# EAGLE design m1-center-plane (EAGLE 9.5.2)
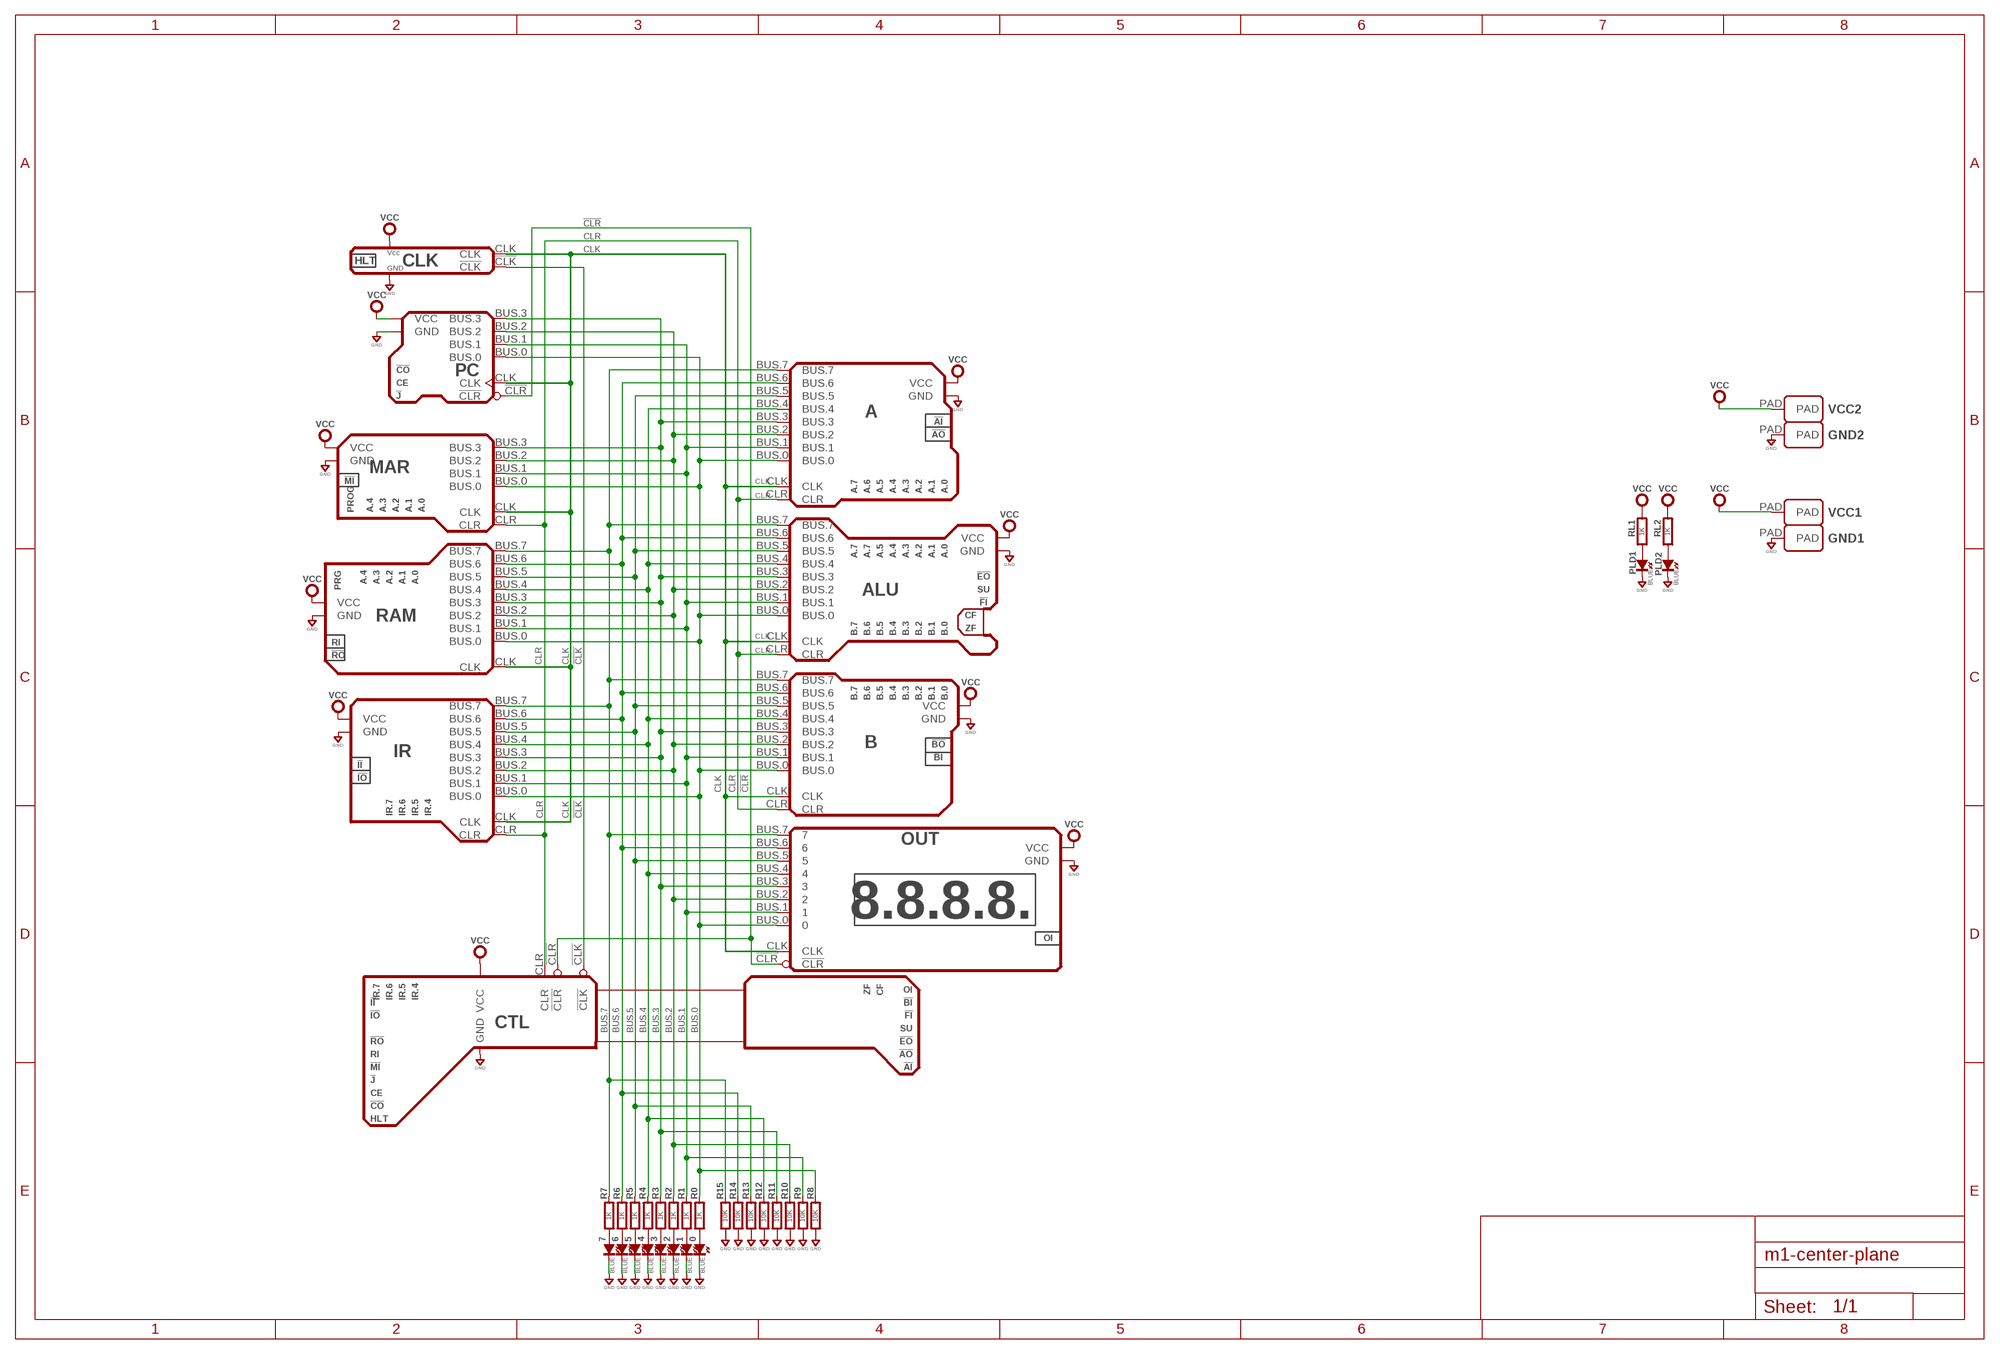
[diagram p0: schematic, sheet 1]

## Parts
0  BLUE  SMT0603  [SMD_0603]
1  BLUE  SMT0603  [SMD_0603]
2  BLUE  SMT0603  [SMD_0603]
3  BLUE  SMT0603  [SMD_0603]
4  BLUE  SMT0603  [SMD_0603]
5  BLUE  SMT0603  [SMD_0603]
6  BLUE  SMT0603  [SMD_0603]
7  BLUE  SMT0603  [SMD_0603]
A  M1-REG-A-BUS  [M1-REG-A-BUS]
ALU  M1-ALU-BUS  [M1-ALU-BUS]
B  M1-REG-B-BUS  [M1-REG-B-BUS]
CLK  M1-CLOCK-BUS  [M1-CLOCK-BUS]
CTL  M1-CONTROL-BUS  [M1-CONTROL-BUS]
GND1  PADSMD-100X100  [SMD-100X100]
GND2  PADSMD-100X100  [SMD-100X100]
IR  M1-REG-INSTR-BUS  [M1-REG-I-BUS]
MAR  M1-MAR-BUS  [M1-MAR-BUS]
OUT  M1-REG-OUTPUT-BUS  [M1-REG-OUTPUT-BUS]
PC  M1-PROG-COUNTER-BUS  [M1-PROGRAM-COUNTER-BUS]
PLD1  BLUE  SMT0603  [SMD_0603]
PLD2  BLUE  SMT0603  [SMD_0603]
R0  1K  RESISTOR0603  [0603-RES]
R1  1K  RESISTOR0603  [0603-RES]
R2  1K  RESISTOR0603  [0603-RES]
R3  1K  RESISTOR0603  [0603-RES]
R4  1K  RESISTOR0603  [0603-RES]
R5  1K  RESISTOR0603  [0603-RES]
R6  1K  RESISTOR0603  [0603-RES]
R7  1K  RESISTOR0603  [0603-RES]
R8  10K  RESISTOR0603  [0603-RES]
R9  10K  RESISTOR0603  [0603-RES]
R10  10K  RESISTOR0603  [0603-RES]
R11  10K  RESISTOR0603  [0603-RES]
R12  10K  RESISTOR0603  [0603-RES]
R13  10K  RESISTOR0603  [0603-RES]
R14  10K  RESISTOR0603  [0603-RES]
R15  10K  RESISTOR0603  [0603-RES]
RAM  M1-RAM-BUS  [M1-RAM-BUS]
RL1  1K  RESISTOR0603  [0603-RES]
RL2  1K  RESISTOR0603  [0603-RES]
VCC1  PADSMD-100X100  [SMD-100X100]
VCC2  PADSMD-100X100  [SMD-100X100]

## Nets
!CLK: CLK.!CLK CTL.!CLK
!CLR: CTL.!CLR OUT.!CLR PC.!CLR
BUS.0: A.BUS.0 ALU.BUS.0 B.BUS.0 IR.BUS.0 MAR.BUS.0 OUT.BUS.0 PC.BUS.0 R0.2 R8.2 RAM.BUS.0
BUS.1: A.BUS.1 ALU.BUS.1 B.BUS.1 IR.BUS.1 MAR.BUS.1 OUT.BUS.1 PC.BUS.1 R1.2 R9.2 RAM.BUS.1
BUS.2: A.BUS.2 ALU.BUS.2 B.BUS.2 IR.BUS.2 MAR.BUS.2 OUT.BUS.2 PC.BUS.2 R2.2 R10.2 RAM.BUS.2
BUS.3: A.BUS.3 ALU.BUS.3 B.BUS.3 IR.BUS.3 MAR.BUS.3 OUT.BUS.3 PC.BUS.3 R3.2 R11.2 RAM.BUS.3
BUS.4: A.BUS.4 ALU.BUS.4 B.BUS.4 IR.BUS.4 OUT.BUS.4 R4.2 R12.2 RAM.BUS.4
BUS.5: A.BUS.5 ALU.BUS.5 B.BUS.5 IR.BUS.5 OUT.BUS.5 R5.2 R13.2 RAM.BUS.5
BUS.6: A.BUS.6 ALU.BUS.6 B.BUS.6 IR.BUS.6 OUT.BUS.6 R6.2 R14.2 RAM.BUS.6
BUS.7: A.BUS.7 ALU.BUS.7 B.BUS.7 IR.BUS.7 OUT.BUS.7 R7.2 R15.2 RAM.BUS.7
CLK: A.CLK ALU.CLK B.CLK CLK.CLK IR.CLK MAR.CLK OUT.CLK PC.CLK RAM.CLK
CLR: A.CLR ALU.CLR B.CLR CTL.CLR IR.CLR MAR.CLR
GND: 0.K(C) 1.K(C) 2.K(C) 3.K(C) 4.K(C) 5.K(C) 6.K(C) 7.K(C) A.GND ALU.GND B.GND CLK.GND CTL.GND GND1.PAD GND2.PAD IR.GND MAR.GND OUT.GND PC.GND PLD1.K(C) PLD2.K(C) R8.1 R9.1 R10.1 R11.1 R12.1 R13.1 R14.1 R15.1 RAM.GND
N$1: 0.A R0.1
N$2: 1.A R1.1
N$3: 2.A R2.1
N$4: 3.A R3.1
N$5: 4.A R4.1
N$6: 5.A R5.1
N$7: 6.A R6.1
N$8: 7.A R7.1
N$9: PLD2.A RL2.1
N$10: PLD1.A RL1.1
VCC: A.VCC ALU.VCC B.VCC CLK.VCC CTL.VCC IR.VCC MAR.VCC OUT.VCC PC.VCC RAM.VCC RL1.2 RL2.2 VCC1.PAD VCC2.PAD

## Library data of the parts
0 1-7 PLD1 PLD2 = led:SMT: LED SMT
A = circuitmonkey-m1-computer:M1-REG-A-BUS: M1 - Register A - Bus Side
ALU = circuitmonkey-m1-computer:M1-ALU-BUS: M1 - ALU - Bus Side
B = circuitmonkey-m1-computer:M1-REG-B-BUS: M1 - Register B - Bus Side
CLK = circuitmonkey-m1-computer:M1-CLOCK-BUS: M1 - Clock - Bus Side
CTL = circuitmonkey-m1-computer:M1-CONTROL-BUS: M1 - Control Logic - Bus Side
GND1 GND2 VCC1 VCC2 = con-testpoints:PAD: Solder Pad
IR = circuitmonkey-m1-computer:M1-REG-INSTR-BUS: M1 - Instruction Register - Bus Side
MAR = circuitmonkey-m1-computer:M1-MAR-BUS: M1 - Memory Address Register - Bus Side
OUT = circuitmonkey-m1-computer:M1-REG-OUTPUT-BUS: M1 - Output Register - Bus Side
PC = circuitmonkey-m1-computer:M1-PROG-COUNTER-BUS: M1 - Program Counter - Bus Side
R0 R1-R15 RL1 RL2 = rlc:RESISTOR: Resistor
RAM = circuitmonkey-m1-computer:M1-RAM-BUS: M1 - RAM - Bus Side

## Board
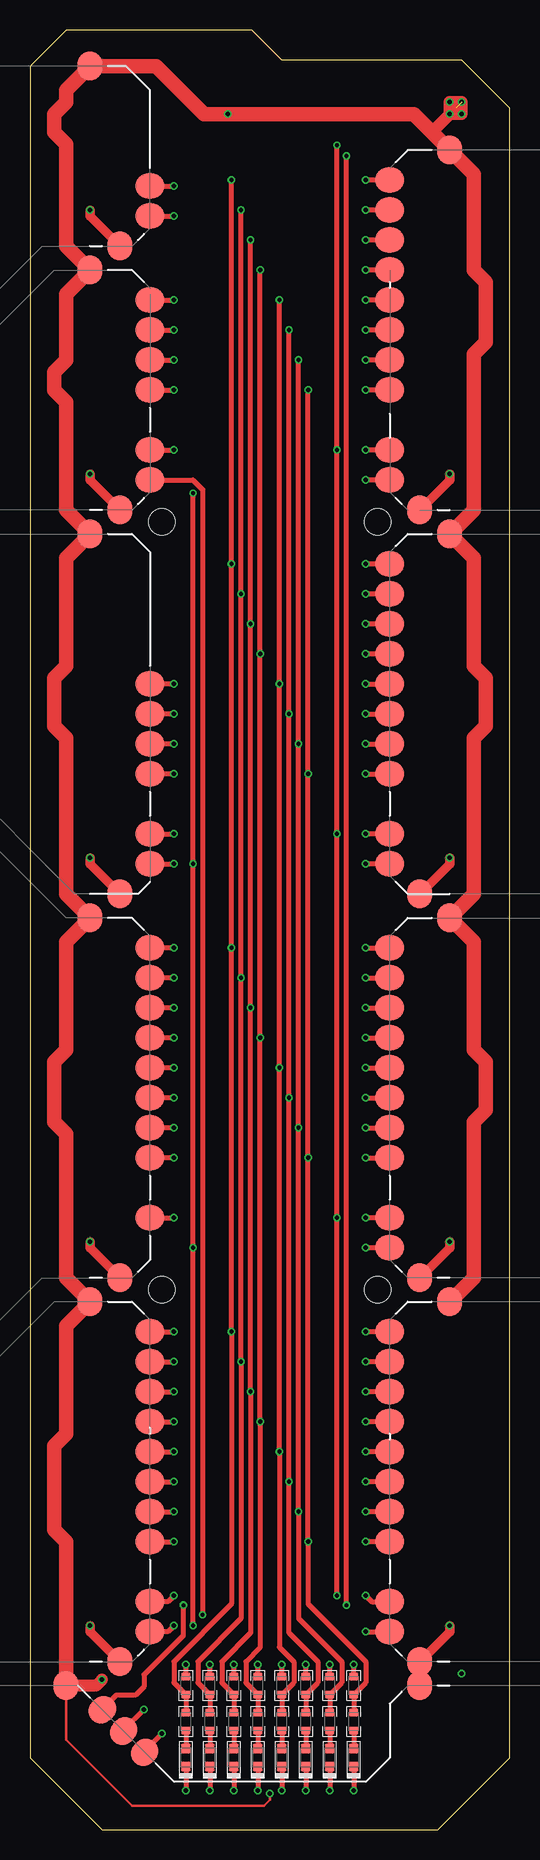
[diagram p1: board, top side]
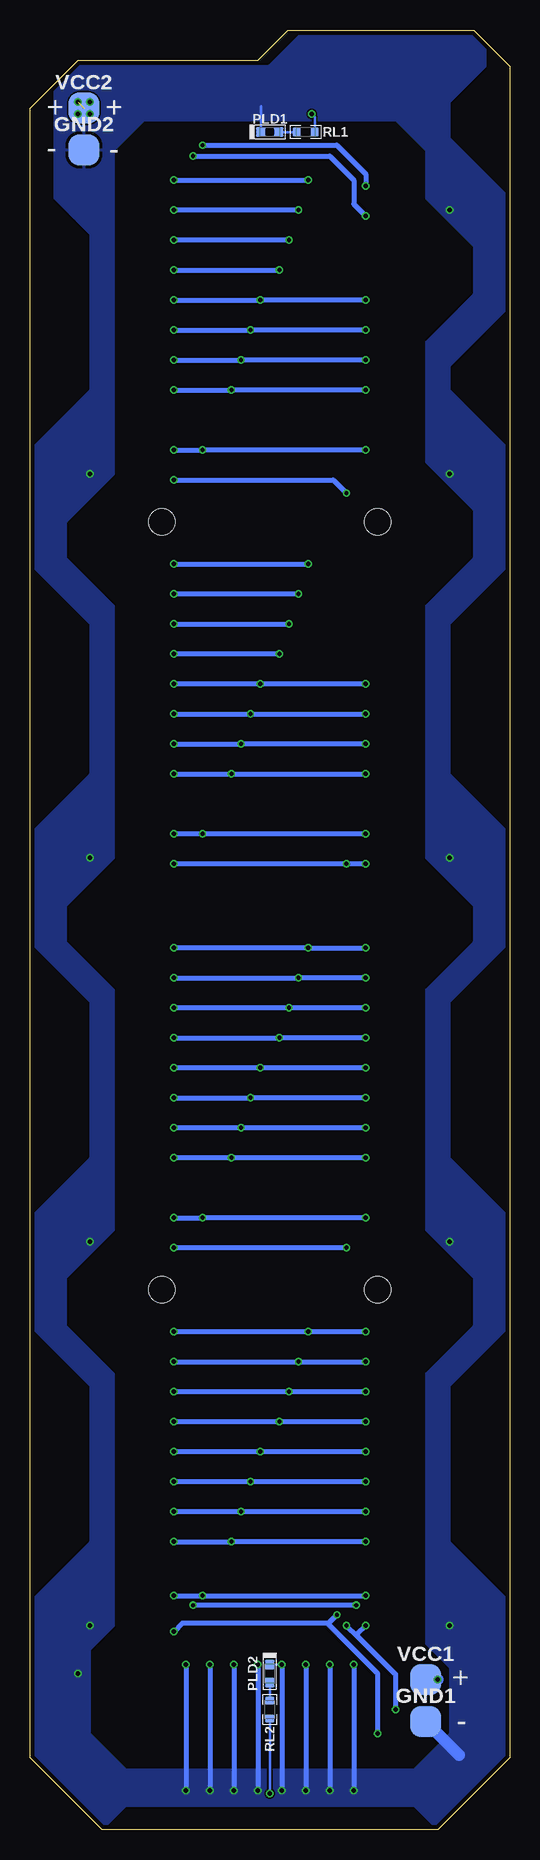
[diagram p2: board, bottom side, seen from below]

Size 40 x 150 mm. Coordinates in mm from the lower left corner, seen from the top.
Outline: 6,0 34,0 40,6 40,143.5 36,147.5 21,147.5 18.5,150 3,150 0,147 0,6 6,0
Copper layers (1*16): Top 0.0356mm / dielectric 1.5011mm / Bottom 0.0356mm
Design rules "OSH-CircuitMonkey *": minimum track width 6mil, minimum drill 12mil, track to track 6mil, track to pad 6mil, pad to pad 6mil, via to via 6mil, smd to smd 6mil, copper to edge 15mil, drill to drill 6mil, minimum pad ring 0.148590625mm, minimum via ring 5mil, stop-mask expansion 3mil, vias tented up to drill 14mil, thermal gap 10mil
Holes 2.2 mm at 29,45 11,45 29,109 11,109

### Footprints (pad centres in the part's own frame; a part is rotated, then mirrored left to right if it is on the bottom)
SMD_0603 = smd 0.8 x 0.8: A 0.75,0; K -0.75,0
M1-REG-A-BUS = smd 2.4 x 2.1: BUS.0 0,-5; BUS.1 0,-2.5; BUS.2 0,0; BUS.3 0,2.5; BUS.4 0,5; BUS.5 0,7.5; BUS.6 0,10; BUS.7 0,12.5; CLK 0,-10; CLR 0,-12.5 | smd 2.1 x 2.4: GND 2.5,-15; VCC 5,15
M1-ALU-BUS = smd 2.4 x 2.1: BUS.0 0,-5; BUS.1 0,-2.5; BUS.2 0,0; BUS.3 0,2.5; BUS.4 0,5; BUS.5 0,7.5; BUS.6 0,10; BUS.7 0,12.5; CLK 0,-10; CLR 0,-12.5 | smd 2.1 x 2.4: GND 2.5,-15; VCC 5,15
M1-REG-B-BUS = smd 2.4 x 2.1: BUS.0 0,-5; BUS.1 0,-2.5; BUS.2 0,0; BUS.3 0,2.5; BUS.4 0,5; BUS.5 0,7.5; BUS.6 0,10; BUS.7 0,12.5; CLK 0,-10; CLR 0,-12.5 | smd 2.1 x 2.4: GND 2.5,-15; VCC 5,15
M1-CLOCK-BUS = smd 2.4 x 2.1: !CLK 0,-7.5; CLK 0,-5 | smd 2.1 x 2.4: GND -2.5,-10; VCC -5,5
M1-CONTROL-BUS = smd 2.4 x 2.1 rotated 45: !CLK -13.961,7.975; !CLR -10.425,4.439; CLR -12.193,6.207 | smd 2.1 x 2.4: GND 12.5,10; VCC -17,10
SMD-100X100 = smd 2.54 x 2.54: PAD 0,0
M1-REG-I-BUS = smd 2.4 x 2.1: BUS.0 0,-5; BUS.1 0,-2.5; BUS.2 0,0; BUS.3 0,2.5; BUS.4 0,5; BUS.5 0,7.5; BUS.6 0,10; BUS.7 0,12.5; CLK 0,-10; CLR 0,-12.5 | smd 2.1 x 2.4: GND -2.5,-15; VCC -5,15
M1-MAR-BUS = smd 2.4 x 2.1: BUS.0 0,-10; BUS.1 0,-7.5; BUS.2 0,-5; BUS.3 0,-2.5; CLK 0,-15; CLR 0,-17.5 | smd 2.1 x 2.4: GND -2.5,-20; VCC -5,10
M1-REG-OUTPUT-BUS = smd 2.4 x 2.1: !CLR 0,-12.5; BUS.0 0,-5; BUS.1 0,-2.5; BUS.2 0,0; BUS.3 0,2.5; BUS.4 0,5; BUS.5 0,7.5; BUS.6 0,10; BUS.7 0,12.5; CLK 0,-10 | smd 2.1 x 2.4: GND 2.5,-15; VCC 5,15
M1-PROGRAM-COUNTER-BUS = smd 2.4 x 2.1: !CLR 0,-7.5; BUS.0 0,0; BUS.1 0,2.5; BUS.2 0,5; BUS.3 0,7.5; CLK 0,-5 | smd 2.1 x 2.4: GND -2.5,-10; VCC -5,10
0603-RES = smd 0.711 x 0.762: 1 -0.752,0; 2 0.752,0
M1-RAM-BUS = smd 2.4 x 2.1: BUS.0 0,-10; BUS.1 0,-7.5; BUS.2 0,-5; BUS.3 0,-2.5; BUS.4 0,0; BUS.5 0,2.5; BUS.6 0,5; BUS.7 0,7.5; CLK 0,-15 | smd 2.1 x 2.4: GND -2.5,-20; VCC -5,10

### Placement (x,y rotation side)
0  27,6 90 top
1  25,6 90 top
2  23,6 90 top
3  21,6 90 top
4  19,6 90 top
5  17,6 90 top
6  15,6 90 top
7  13,6 90 top
A  30,125 0 top
ALU  30,93 0 top
B  30,61 0 top
CLK  10,142 0 top
CTL  20,2 0 top
GND1  7,9 0 bottom
GND2  35.5,140 0 bottom
IR  10,29 0 top
MAR  10,98 0 top
OUT  30,29 0 top
PC  10,120 0 top
PLD1  20,141.5 0 bottom
PLD2  20,13 270 bottom
R0  27,9 90 top
R1  25,9 90 top
R2  23,9 90 top
R3  21,9 90 top
R4  19,9 90 top
R5  17,9 90 top
R6  15,9 90 top
R7  13,9 90 top
R8  27,12 270 top
R9  25,12 270 top
R10  23,12 270 top
R11  21,12 270 top
R12  19,12 270 top
R13  17,12 270 top
R14  15,12 270 top
R15  13,12 270 top
RAM  10,66 0 top
RL1  17,141.5 0 bottom
RL2  20,10 270 bottom
VCC1  7,12.5 0 bottom
VCC2  35.5,143.5 0 bottom

### Tracks (layer width: path | path; a pad name or v marks a point on that pad's centre or on a via)
!CLK  (via drill 0.35)
  Top 0.4: v26.4,18.7 v26.4,139.5 | v12.8,18.7 12.8,16.2 9.5,12.9 9.5,11.9 8.8,11.2 7.2,11.2 6.04,10.04 CTL.!CLK | CLK.!CLK v12,134.5
  Bottom 0.4: v12.8,18.7 v26.4,18.7 | v26.4,139.5 15,139.5 13,137.5 13,135.5 v12,134.5
!CLR  (via drill 0.35)
  Top 0.4: v14.4,17.9 14.4,111.7 13.6,112.5 PC.!CLR | v28,16.5 OUT.!CLR | v11,8 9.57,6.58 CTL.!CLR
  Bottom 0.4: v14.4,17.9 15.1,17.2 15.2,17.2 | 15.2,17.2 27.3,17.2 v28,16.5 | v11,8 11,13 15.2,17.2
BUS.0  (via drill 0.35)
  Top 0.4: v23.2,120 v23.2,88 v23.2,56 v23.2,24 23.2,18.8 28,14 28,12.25 R8.2 R0.2 | OUT.BUS.0 v28,24 | IR.BUS.0 v12,24 | v12,56 RAM.BUS.0 | v28,56 B.BUS.0 | v12,88 MAR.BUS.0 | v28,88 ALU.BUS.0 | A.BUS.0 v28,120 | PC.BUS.0 v12,120
  Bottom 0.4: v28,24 v23.2,24 v12,24 | v12,56 v23.2,56 v28,56 | v28,88 v23.2,88 v12,88 | v12,120 v23.2,120 v28,120
BUS.1  (via drill 0.35)
  Top 0.4: v22.4,122.5 v22.4,90.5 v22.4,58.5 v22.4,26.5 22.4,17.6 26,14 26,12.25 R9.2 R1.2 | OUT.BUS.1 v28,26.5 | IR.BUS.1 v12,26.5 | v12,58.5 RAM.BUS.1 | v28,58.5 B.BUS.1 | v12,90.5 MAR.BUS.1 | v28,90.5 ALU.BUS.1 | A.BUS.1 v28,122.5 | PC.BUS.1 v12,122.5
  Bottom 0.4: v12,26.5 v22.4,26.5 v28,26.5 | v12,58.5 v22.4,58.5 v28,58.5 | v28,90.5 v22.4,90.5 v12,90.5 | v12,122.5 v22.4,122.5 v28,122.5
BUS.2  (via drill 0.35)
  Top 0.4: v21.6,125 v21.6,93 v21.6,61 v21.6,29 21.6,16.4 24,14 24,12.25 R10.2 R2.2 | OUT.BUS.2 v28,29 | IR.BUS.2 v12,29 | v12,61 RAM.BUS.2 | v28,61 B.BUS.2 | v12,93 MAR.BUS.2 | v28,93 ALU.BUS.2 | ALU.BUS.2 30.6,93 30.8,93.2 30.2,93.2 ALU.BUS.2 | A.BUS.2 v28,125 | PC.BUS.2 v12,125
  Bottom 0.4: v12,29 v21.6,29 v28,29 | v12,61 v21.6,61 v28,61 | v28,93 v21.6,93 v12,93 | v12,125 v21.6,125 v28,125
BUS.3  (via drill 0.35)
  Top 0.4: v20.8,127.5 v20.8,95.5 v20.8,63.5 v20.8,31.5 20.8,15.2 22,14 22,12.25 R11.2 R3.2 | OUT.BUS.3 v28,31.5 | IR.BUS.3 v12,31.5 | v12,63.5 RAM.BUS.3 | v28,63.5 B.BUS.3 | v12,95.5 MAR.BUS.3 | v28,95.5 ALU.BUS.3 | A.BUS.3 v28,127.5 | PC.BUS.3 v12,127.5
  Bottom 0.4: v12,31.5 v20.8,31.5 v28,31.5 | v12,63.5 v20.8,63.5 v28,63.5 | v28,95.5 v20.8,95.5 v12,95.5 | v12,127.5 v20.8,127.5 v28,127.5
BUS.4  (via drill 0.35)
  Top 0.4: v19.2,130 v19.2,98 v19.2,66 v19.2,34 19.2,15.2 18,14 18,12.25 R12.2 R4.2 | OUT.BUS.4 v28,34 | IR.BUS.4 v12,34 | v12,66 RAM.BUS.4 | v28,66 B.BUS.4 | ALU.BUS.4 v28,98 | A.BUS.4 v28,130
  Bottom 0.4: v12,34 v19.2,34 v28,34 | v12,66 v19.2,66 v28,66 | v19.2,98 v28,98 | v28,130 v19.2,130
BUS.5  (via drill 0.35)
  Top 0.4: v18.4,132.5 v18.4,100.5 v18.4,68.5 v18.4,36.5 18.4,16.4 16,14 16,12.25 R13.2 R5.2 | OUT.BUS.5 v28,36.5 | IR.BUS.5 v12,36.5 | v12,68.5 RAM.BUS.5 | v28,68.5 B.BUS.5 | ALU.BUS.5 v28,100.5 | A.BUS.5 v28,132.5
  Bottom 0.4: v12,36.5 v18.4,36.5 v28,36.5 | v12,68.5 v18.4,68.5 v28,68.5 | v28,100.5 v18.4,100.5 | v18.4,132.5 v28,132.5
BUS.6  (via drill 0.35)
  Top 0.4: v17.6,135 v17.6,103 v17.6,71 v17.6,39 17.6,17.6 14,14 14,12.25 R14.2 R6.2 | OUT.BUS.6 v28,39 | IR.BUS.6 v12,39 | v12,71 RAM.BUS.6 | v28,71 B.BUS.6 | ALU.BUS.6 v28,103 | A.BUS.6 v28,135
  Bottom 0.4: v28,39 v17.6,39 v12,39 | v12,71 v17.6,71 v28,71 | v17.6,103 v28,103 | v17.6,135 v28,135
BUS.7  (via drill 0.35)
  Top 0.4: v16.8,137.5 v16.8,105.5 v16.8,73.5 v16.8,41.5 16.8,18.8 12,14 12,12.25 R15.2 R7.2 | OUT.BUS.7 v28,41.5 | IR.BUS.7 v12,41.5 | v12,73.5 RAM.BUS.7 | v28,73.5 B.BUS.7 | ALU.BUS.7 v28,105.5 | A.BUS.7 v28,137.5
  Bottom 0.4: v12,41.5 v16.8,41.5 v28,41.5 | v28,73.5 v16.8,73.5 v12,73.5 | v28,105.5 v16.8,105.5 | v28,137.5 v16.8,137.5
CLK  (via drill 0.35)
  Top 0.4: v25.6,140.4 v25.6,115 v25.6,83 v25.6,51 v25.6,19.5 | v12,19.5 11.5,19 IR.CLK | v28,19.5 28.5,19 OUT.CLK | RAM.CLK v12,51 | B.CLK v28,51 | A.CLK v28,115 | PC.CLK v12,115 | CLK.CLK v12,137 | MAR.CLK v12,83 | ALU.CLK v28,83
  Bottom 0.4: v28,51 v25.6,51 v12,51 | v28,19.5 v25.6,19.5 v12,19.5 | v12,115 v25.6,115 v28,115 | v12,83 v25.6,83 v28,83 | v25.6,140.4 14.4,140.4 12,138 v12,137
CLR  (via drill 0.35)
  Top 0.4: v13.6,111.4 v13.6,80.5 v13.6,48.5 v13.6,17 | v12,17 11.5,16.5 IR.CLR | B.CLR v28,48.5 | A.CLR v28,112.5 | v9.5,10 7.81,8.31 CTL.CLR | MAR.CLR v12,80.5 | ALU.CLR v28,80.5
  Bottom 0.4: v9.5,10 9.5,12.9 12.7,16.1 | v13.6,48.5 v28,48.5 | v28,112.5 14.7,112.5 v13.6,111.4 | v12,80.5 v13.6,80.5 v28,80.5 | v13.6,17 12.7,16.1 | v12,17 12.7,16.3 12.7,16.1
GND  (via drill 0.35)
  Top 0.4: R15.1 v13,13.75 | R14.1 v15,13.75 | R13.1 v17,13.75 | R12.1 v19,13.75 | R11.1 v21,13.75 | R10.1 v23,13.75 | R9.1 v25,13.75 | R8.1 v27,13.75 | CTL.GND 32.5,13 | 7.K v13,3.25 | 6.K v15,3.25 | 5.K v17,3.25 | 4.K v19,3.25 | 3.K v21,3.25 | 2.K v23,3.25 | 1.K v25,3.25 | 0.K v27,3.25
  Top 0.8: v5,17 5,16.5 IR.GND | v35,49 35,48.5 B.GND | 32.5,13 OUT.GND 35,16.5 v35,17 | RAM.GND 5,48.5 v5,49 | MAR.GND 5,80.5 v5,81 | PC.GND 5,112.5 v5,113 | CLK.GND 5,134.5 v5,135 | A.GND 35,112.5 v35,113 | ALU.GND 35,80.5 v35,81
  Bottom 0.152: v19,13.75 PLD2.K
  Bottom 0.2: PLD1.K 20.75,143.65
  Bottom 0.4: v13,13.75 v13,3.25 | v15,13.75 v15,3.25 | v17,13.75 v17,3.25 | v19,13.75 v19,3.25 | v21,13.75 v21,3.25 | v23,13.75 v23,3.25 | v25,13.75 v25,3.25 | v27,13.75 v27,3.25
  Bottom 1: GND1.PAD 4.2,6.2
  other vias: 36,13
  pour Bottom: 0,6 0,19 5,24 5,37 0,42 0,51 5,56 5,69 0,74 0,83 5,88 5,100.5 0,105.5 0,115 5,120 5,122 0,127 0,136 5,141 5,144 2,147 2,148.5 3,149.5 17.6,149.5 20,147.1 20,142.5 9.5,142.5 7,140 7,136 3,132 3,128 7,124 7,114 3,110 3,106 7,102 7,81 3,77 3,74 7,70 7,50 3,46 3,42 7,38 7,15.5 5,13.5 5,8 8,5 32,5 35,8 35,15 33,17 33,38 37,42 37,46 33,50 33,70 37,74 37,77 33,81 33,102 37,106 37,109 33,113 33,140 30.5,142.5 20.1,142.5 20.1,147 36,147 38,145 38,136 35,133 35,120 40,115 40,105.5 35,100.5 35,88 40,83 40,74 35,69 35,56 40,51 40,42 35,37 35,24 40,19 40,6 34,0 32,2 8,2 6,0
N$1
  Top 0.4: R0.1 0.A
N$2
  Top 0.4: R1.1 1.A
N$3
  Top 0.4: R2.1 2.A
N$4
  Top 0.4: R3.1 3.A
N$5
  Top 0.4: R4.1 4.A
N$6
  Top 0.4: R5.1 5.A
N$7
  Top 0.4: R6.1 6.A
N$8
  Top 0.4: R7.1 7.A
N$9
  Bottom 0.2: RL2.1 PLD2.A
N$10
  Bottom 0.2: RL1.1 PLD1.A
VCC  (via drill 0.35)  (1 unrouted)
  Top 0.2: CTL.VCC 3,7.5 8.5,2 19.5,2 20,2.5 v20,3
  Top 0.28: 21.25,143.25 21,143 | 18.75,143.25 18.5,143
  Top 1: v6,12.5 5.5,12 CTL.VCC | A.VCC 33.5,141.5 v35,143 | v35,143 v36,143 v36,144 v35,144 v35,143
  Top 1.2: CTL.VCC 3,24 2,25 2,32 3,33 3,42 IR.VCC 3,46 3,58 2,59 2,64 3,65 3,74 RAM.VCC 3,78 3,91 2,92 2,96 3,97 3,106 MAR.VCC 3,110 3,119 2,120 2,121.5 3,122.5 3,128 PC.VCC 3,132 3,140.5 2,141.5 2,143 3,144 3,145 CLK.VCC 10.5,147 14.5,143 v16.5,143 18.5,143 21,143 32,143 A.VCC 37,138 37,130 38,129 38,124 37,123 37,110 ALU.VCC 37,106 37,97 38,96 38,92 37,91 37,78 B.VCC 37,74 37,65 38,64 38,60 37,59 37,46 OUT.VCC
  Bottom 0.2: v20,3 RL2.2 | RL1.2 16.25,142.75 v16.5,143
  Bottom 1: VCC1.PAD v6,12.5

### Text on the board
bPlace: + | + | - | - | + | -